# Altium schematic sheet LaserDiode_Driver.SchDoc: DEV OPAMP SOT5/6-23 (part 1 of 2)
size 431 x 279 mm; DrawnBy: K. Heyer; Organization: ORGANIZATION; Address1: 207; Address2: 13399 104 Ave; Address3: Surrey BC, V3T 0C9; Address4: Canada; Revision: V0.0.1; SheetNumber: 1; SheetTotal: 1; Project: Development; ENG_APP_DATE: --/--/--; DSN_APP_DATE: --/--/--; CHK_APP_DATE: --/--/--
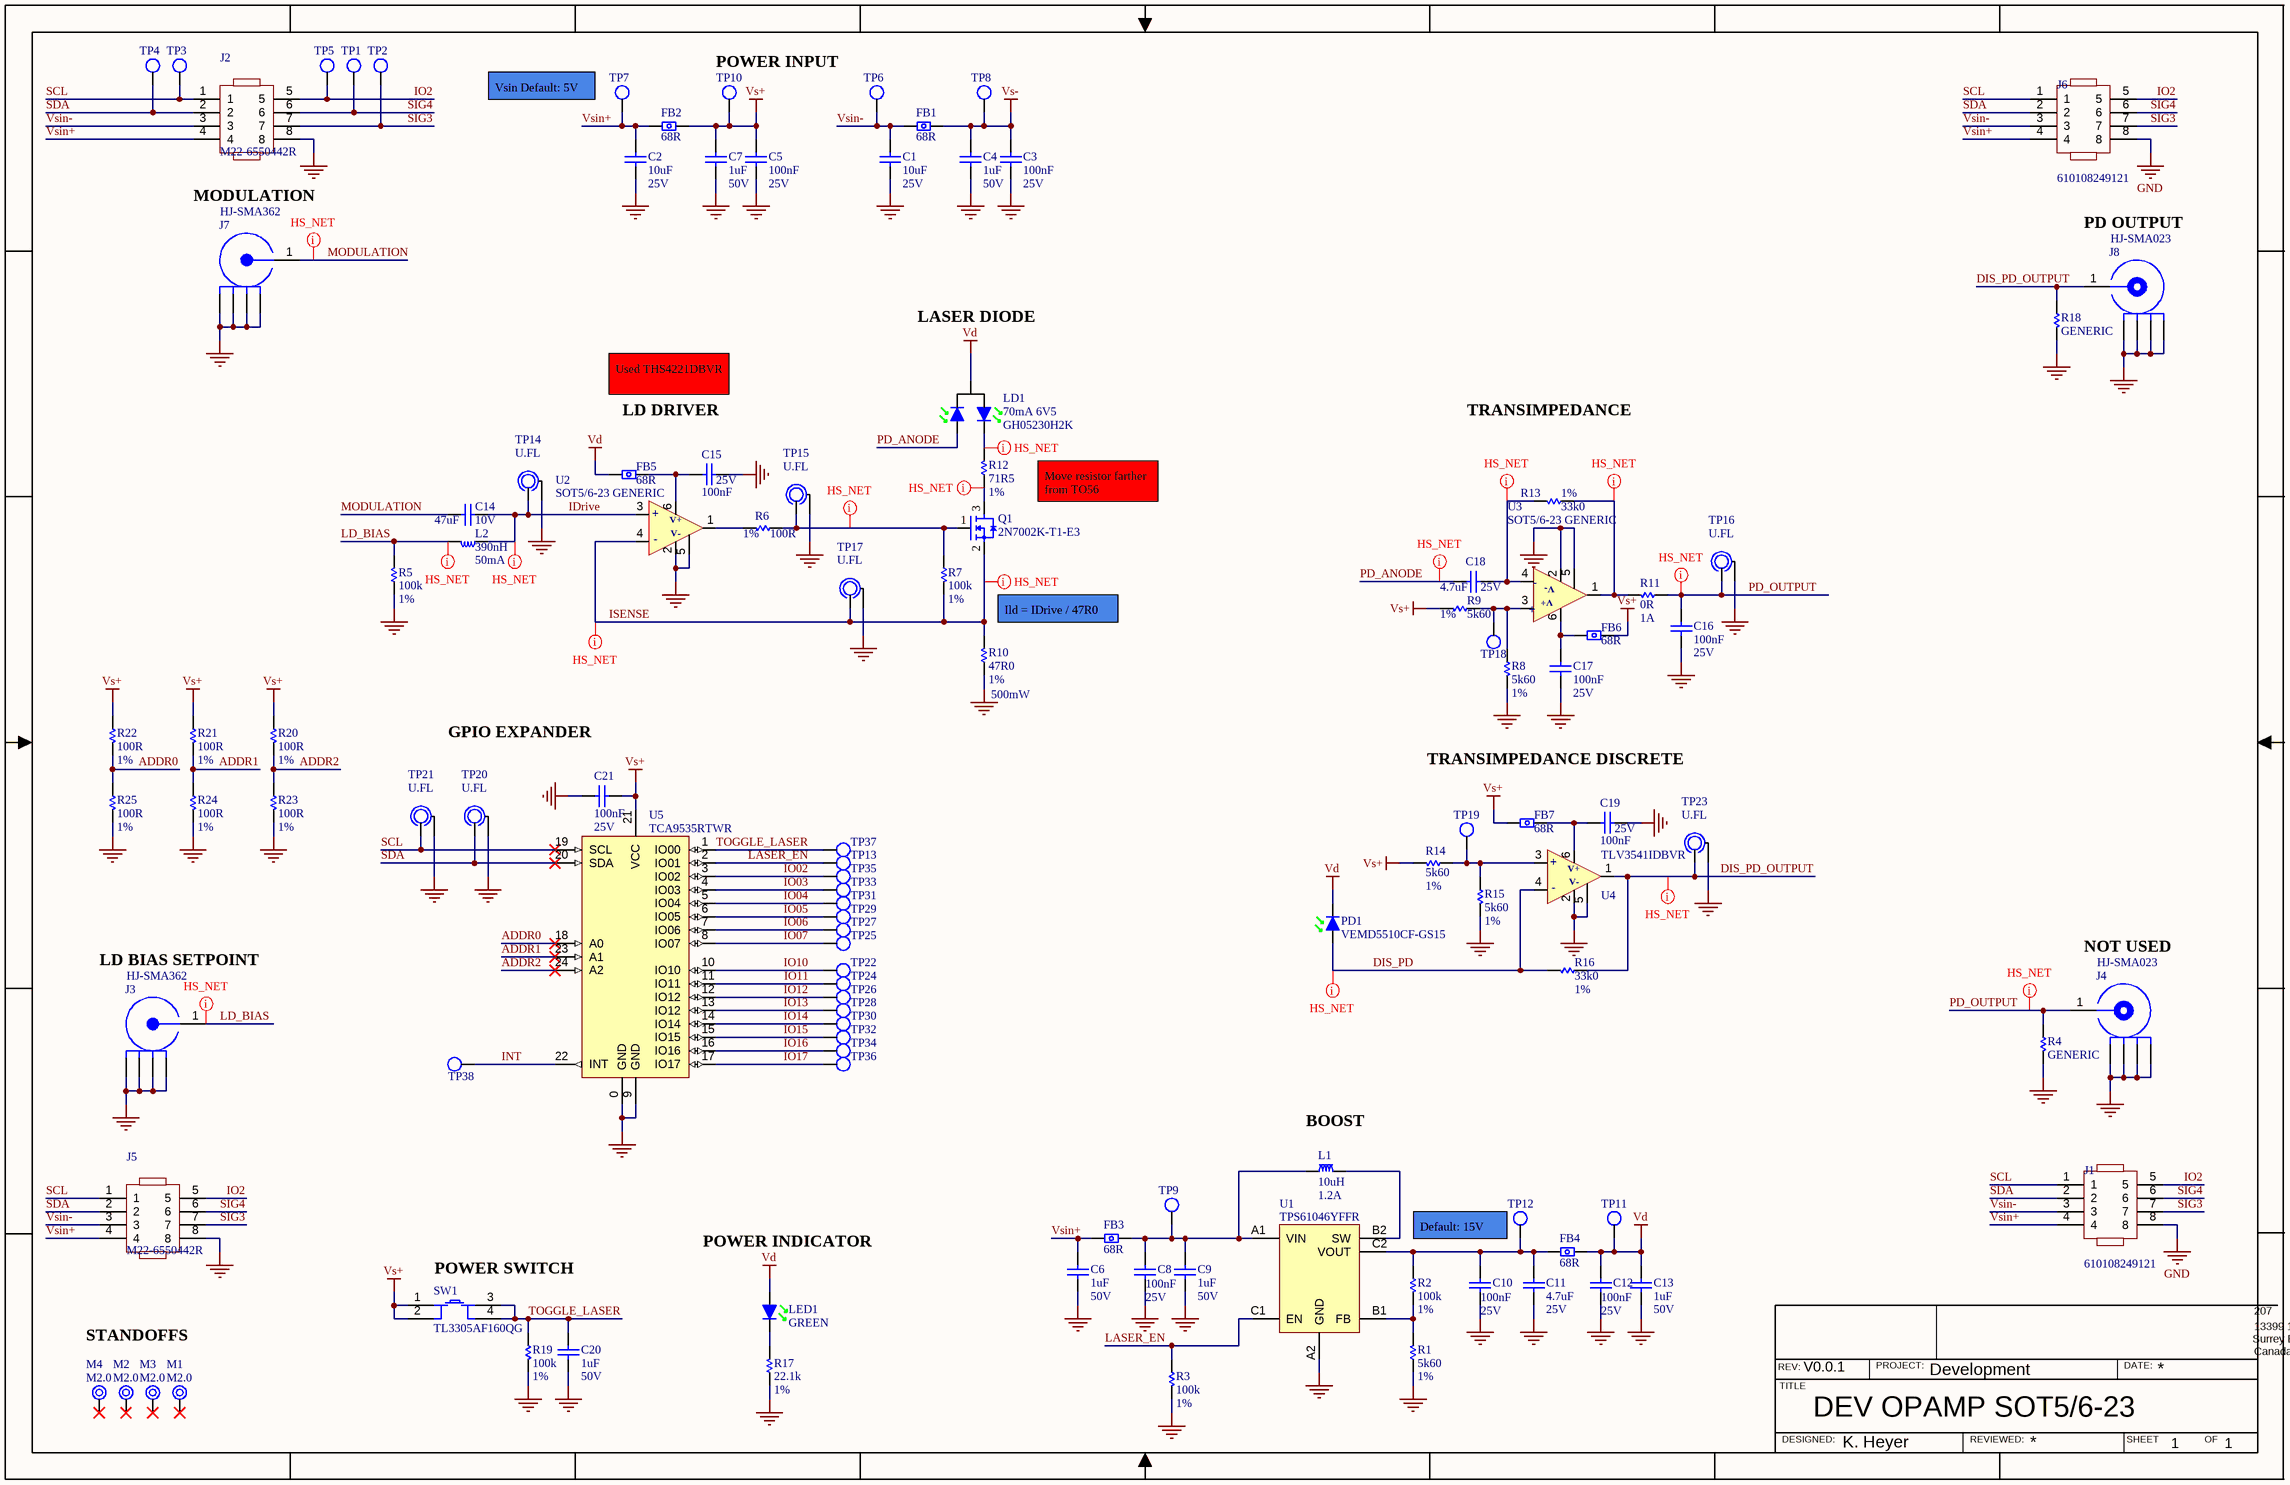
[diagram p0: LaserDiode_Driver.SchDoc]

## Parts
C1  10uF  Voltage Rating: 25V  [c0805]
C2  10uF  Voltage Rating: 25V  [c0805]
C3  100nF  Voltage Rating: 25V  [C0402]
C4  1uF  Voltage Rating: 50V  [c0603]
C5  100nF  Voltage Rating: 25V  [C0402]
C6  1uF  Voltage Rating: 50V  [c0603]
C7  1uF  Voltage Rating: 50V  [c0603]
C8  100nF  Voltage Rating: 25V  [C0402]
C9  1uF  Voltage Rating: 50V  [c0603]
C10  100nF  Voltage Rating: 25V  [C0402]
C11  4.7uF  Voltage Rating: 25V  [c0805]
C12  100nF  Voltage Rating: 25V  [C0402]
C13  1uF  Voltage Rating: 50V  [c0603]
C14  47uF  Voltage Rating: 10V  [C1210]
C15  100nF  Voltage Rating: 25V  [C0402]
C16  100nF  Voltage Rating: 25V  [C0402]
C17  100nF  Voltage Rating: 25V  [C0402]
C18  4.7uF  Voltage Rating: 25V  [c0805]
C19  100nF  Voltage Rating: 25V  [C0402]
C20  1uF  Voltage Rating: 50V  [c0603]
C21  100nF  Voltage Rating: 25V  [C0402]
FB1  68R  [FB0402]
FB2  68R  [FB0402]
FB3  68R  [FB0402]
FB4  68R  [FB0402]
FB5  68R  [FB0402]
FB6  68R  [FB0402]
FB7  68R  [FB0402]
J1  610108249121  [CONN HDR 08 MALE RA 2ROW - duplicate]
J2  M22-6550442R  [CONN HDR 08 FEMALE RA 2ROW]
J3  HJ-SMA362  [SMA SMD PIN BRD EDGE]
J4  HJ-SMA023  [SMA SMD BORE BRD EDGE]
J5  M22-6550442R  [CONN HDR 08 FEMALE RA 2ROW]
J6  610108249121  [CONN HDR 08 MALE RA 2ROW - duplicate]
J7  HJ-SMA362  [SMA SMD PIN BRD EDGE]
J8  HJ-SMA023  [SMA SMD BORE BRD EDGE]
L1  10uH  Current Rating: 1.2A  [INDP4040X27N]
L2  390nH  Current Rating: 50mA  [L0402]
LD1  70mA 6V5  Manufacturer Part Number: GH05230H2K  [LD TO-56]
LED1  GREEN  [led0402 green]
M1  M2.0  [MECH M2.0 UNPLATED]  (no BOM)
M2  M2.0  [MECH M2.0 UNPLATED]  (no BOM)
M3  M2.0  [MECH M2.0 UNPLATED]  (no BOM)
M4  M2.0  [MECH M2.0 UNPLATED]  (no BOM)
PD1  VEMD5510CF-GS15  [PIN 4x5 4pin]
Q1  2N7002K-T1-E3  [SOT 23-3]
R1  5k60  Tolerance: 1%  [R0402]
R2  100k  Tolerance: 1%  [r0402]
R3  100k  Tolerance: 1%  [r0402]
R4  GENERIC  [R0402]
R5  100k  Tolerance: 1%  [r0402]
R6  100R  Tolerance: 1%  [R0402]
R7  100k  Tolerance: 1%  [r0402]
R8  5k60  Tolerance: 1%  [R0402]
R9  5k60  Tolerance: 1%  [R0402]
R10  47R0  Max Power Dissipation: 500mW  Tolerance: 1%  [R0805]
R11  0R  Current Rating: 1A  [R0402]
R12  71R5  Tolerance: 1%  [R0805]
R13  33k0  Tolerance: 1%  [R0603]
R14  5k60  Tolerance: 1%  [R0402]
R15  5k60  Tolerance: 1%  [R0402]
R16  33k0  Tolerance: 1%  [R0603]
R17  22.1k  Tolerance: 1%  [R0402]
R18  GENERIC  [R0402]
R19  100k  Tolerance: 1%  [r0402]
R20  100R  Tolerance: 1%  [R0402]
R21  100R  Tolerance: 1%  [R0402]
R22  100R  Tolerance: 1%  [R0402]
R23  100R  Tolerance: 1%  [R0402]
R24  100R  Tolerance: 1%  [R0402]
R25  100R  Tolerance: 1%  [R0402]
SW1  TL3305AF160QG  [MECH PB TL3305A]
TP1  1mm  [TESTPOINT_SMT]  (value not drawn)  (no BOM)
TP2  1mm  [TESTPOINT_SMT]  (value not drawn)  (no BOM)
TP3  1mm  [TESTPOINT_SMT]  (value not drawn)  (no BOM)
TP4  1mm  [TESTPOINT_SMT]  (value not drawn)  (no BOM)
TP5  1mm  [TESTPOINT_SMT]  (value not drawn)  (no BOM)
TP6  1mm  [TESTPOINT_SMT]  (value not drawn)  (no BOM)
TP7  1mm  [TESTPOINT_SMT]  (value not drawn)  (no BOM)
TP8  1mm  [TESTPOINT_SMT]  (value not drawn)  (no BOM)
TP9  1mm  [TESTPOINT_SMT]  (value not drawn)  (no BOM)
TP10  1mm  [TESTPOINT_SMT]  (value not drawn)  (no BOM)
TP11  1mm  [TESTPOINT_SMT]  (value not drawn)  (no BOM)
TP12  1mm  [TESTPOINT_SMT]  (value not drawn)  (no BOM)
TP13  1mm  [TESTPOINT_SMT]  (value not drawn)  (no BOM)
TP14  U.FL  [U.FL]
TP15  U.FL  [U.FL]
TP16  U.FL  [U.FL]
TP17  U.FL  [U.FL]
TP18  1mm  [TESTPOINT_SMT]  (value not drawn)  (no BOM)
TP19  1mm  [TESTPOINT_SMT]  (value not drawn)  (no BOM)
TP20  U.FL  [U.FL]
TP21  U.FL  [U.FL]
TP22  1mm  [TESTPOINT_SMT]  (value not drawn)  (no BOM)
TP23  U.FL  [U.FL]
TP24  1mm  [TESTPOINT_SMT]  (value not drawn)  (no BOM)
TP25  1mm  [TESTPOINT_SMT]  (value not drawn)  (no BOM)
TP26  1mm  [TESTPOINT_SMT]  (value not drawn)  (no BOM)
TP27  1mm  [TESTPOINT_SMT]  (value not drawn)  (no BOM)
TP28  1mm  [TESTPOINT_SMT]  (value not drawn)  (no BOM)
TP29  1mm  [TESTPOINT_SMT]  (value not drawn)  (no BOM)
TP30  1mm  [TESTPOINT_SMT]  (value not drawn)  (no BOM)
TP31  1mm  [TESTPOINT_SMT]  (value not drawn)  (no BOM)
TP32  1mm  [TESTPOINT_SMT]  (value not drawn)  (no BOM)
TP33  1mm  [TESTPOINT_SMT]  (value not drawn)  (no BOM)
TP34  1mm  [TESTPOINT_SMT]  (value not drawn)  (no BOM)
TP35  1mm  [TESTPOINT_SMT]  (value not drawn)  (no BOM)
TP36  1mm  [TESTPOINT_SMT]  (value not drawn)  (no BOM)
TP37  1mm  [TESTPOINT_SMT]  (value not drawn)  (no BOM)
TP38  1mm  [TESTPOINT_SMT]  (value not drawn)  (no BOM)
U1  TPS61046YFFR  [BGA 2x3 0.8x1.2mm TI-YFF0006]
U2  SOT5/6-23 GENERIC  [SOT23-5/6_Modified]
U3  SOT5/6-23 GENERIC  [SOT23-5/6_Modified]
U4  TLV3541IDBVR  [SOT23-5/6_Modified]
U5  TCA9535RTWR  [QFN50P400X400X80_HS-25N]

## Nets
GND: C1.1 C2.1 C3.1 C4.1 C5.1 C6.1 C7.1 C8.1 C9.1 C10.1 C11.1 C12.1 C13.1 C15.2 C16.2 C17.2 C19.2 C20.1 C21.2 J1.8 J2.8 J3.0 J4.0 J5.8 J6.8 J7.0 J8.0 R1.1 R3.2 R4.2 R5.1 R8.2 R10.1 R15.2 R17.1 R18.2 R19.2 R23.2 R24.2 R25.2 TP14.0 TP15.0 TP16.0 TP17.0 TP20.0 TP21.0 TP23.0 U1.A2(GND) U2.2(V-) U2.5 U3.2(V-) U3.5 U4.2(V-) U4.5 U5.0(GND) U5.9(GND)
Vd: C12.2 C13.2 FB4.2 FB5.2 LD1.2(STEM) LED1.2(A) PD1.1(CA) TP11.1
Vs+: C5.2 C7.2 C21.1 FB2.1 FB6.1 FB7.2 R9.2 R14.2 R20.1 R21.1 R22.1 SW1.1 SW1.2 TP10.1 U5.21(VCC)
Vs-: C3.2 C4.2 FB1.1 TP8.1
ADDR0: R22.2 R25.1 U5.18(A0)
ADDR1: R21.2 R24.1 U5.23(A1)
ADDR2: R20.2 R23.1 U5.24(A2)
DIS_PD: PD1.2(AN) R16.2 U4.4(-)
DIS_PD_OUTPUT: J8.1 R16.1 R18.1 TP23.1 U4.1
IDrive: C14.1 L2.2 TP14.1 U2.3(+)
INT: TP38.1 U5.22(INT)
IO2: J1.5 J2.5 J5.5 J6.5 TP5.1
IO02: TP35.1 U5.3(IO02)
IO03: TP33.1 U5.4(IO03)
IO04: TP31.1 U5.5(IO04)
IO05: TP29.1 U5.6(IO05)
IO06: TP27.1 U5.7(IO06)
IO07: TP25.1 U5.8(IO07)
IO10: TP22.1 U5.10(IO10)
IO11: TP24.1 U5.11(IO11)
IO12: TP26.1 U5.12(IO12)
IO13: TP28.1 U5.13(IO12)
IO14: TP30.1 U5.14(IO14)
IO15: TP32.1 U5.15(IO15)
IO16: TP34.1 U5.16(IO16)
IO17: TP36.1 U5.17(IO17)
ISENSE: Q1.2(S) R7.2 R10.2 TP17.1 U2.4(-)
LASER_EN: R3.1 TP13.1 U1.C1(EN) U5.2(IO01)
LD_BIAS: J3.1 L2.1 R5.2
MODULATION: C14.2 J7.1
PD_ANODE: C18.2 LD1.3(PD)
PD_OUTPUT: C16.1 J4.1 R4.1 R11.1 TP16.1
SCL: J1.1 J2.1 J5.1 J6.1 TP3.1 TP21.1 U5.19(SCL)
SDA: J1.2 J2.2 J5.2 J6.2 TP4.1 TP20.1 U5.20(SDA)
SIG3: J1.7 J2.7 J5.7 J6.7 TP2.1
SIG4: J1.6 J2.6 J5.6 J6.6 TP1.1
TOGGLE_LASER: C20.2 R19.1 SW1.3 SW1.4 TP37.1 U5.1(IO00)
Vsin+: C2.2 C6.2 FB2.2 FB3.1 J1.4 J2.4 J5.4 J6.4 TP7.1
Vsin-: C1.2 FB1.2 J1.3 J2.3 J5.3 J6.3 TP6.1
NetC8_2: C8.2 C9.2 FB3.2 L1.2 TP9.1 U1.A1(VIN)
NetC10_2: C10.2 C11.2 FB4.1 R2.1 TP12.1 U1.C2(VOUT)
NetC15_1: C15.1 FB5.1 U2.6(V+)
NetC17_1: C17.1 FB6.2 U3.6(V+)
NetC18_1: C18.1 R13.2 U3.4(-)
NetC19_1: C19.1 FB7.1 U4.6(V+)
NetL1_1: L1.1 U1.B2(SW)
NetLD1_1: LD1.1(LD) R12.2
NetLED1_1: LED1.1(K) R17.2
NetQ1_1: Q1.1(G) R6.1 R7.1 TP15.1
NetQ1_3: Q1.3(D) R12.1
NetR1_2: R1.2 R2.2 U1.B1(FB)
NetR6_2: R6.2 U2.1
NetR8_1: R8.1 R9.1 TP18.1 U3.3(+)
NetR11_2: R11.2 R13.1 U3.1
NetR14_1: R14.1 R15.1 TP19.1 U4.3(+)

Not connected (* = marked no-connect by the designer): M1 1*; M2 1*; M3 1*; M4 1*

## Layout directives
net class HS_NET; rule Clearance Constraint [Generic clearance = 10mil, and 30 value(s) for objects]; rule Impedance Constraint [Min = 42.50    Max = 57.50    ]: DIS_PD, DIS_PD_OUTPUT, IDrive, ISENSE, LD_BIAS, MODULATION, NetC18_1, NetLD1_1, NetQ1_1, NetQ1_3, NetR11_2, PD_ANODE, PD_OUTPUT

## Notes on the sheet
- (near TP7) Vsin Default: 5V
- (near TP10) POWER INPUT
- MODULATION
- PD OUTPUT
- LASER DIODE
- Used THS4221DBVR
- LD DRIVER
- TRANSIMPEDANCE
- Move resistor farther from TO56
- (near R10) Ild = IDrive / 47R0
- GPIO EXPANDER
- TRANSIMPEDANCE DISCRETE
- LD BIAS SETPOINT
- NOT USED
- (near L1) BOOST
- (near TP12) Default: 15V
- (near SW1) POWER SWITCH
- POWER INDICATOR
- STANDOFFS
- REV:
- PROJECT:
- DATE:
- TITLE
- SHEET
- OF
- DESIGNED:
- REVIEWED: